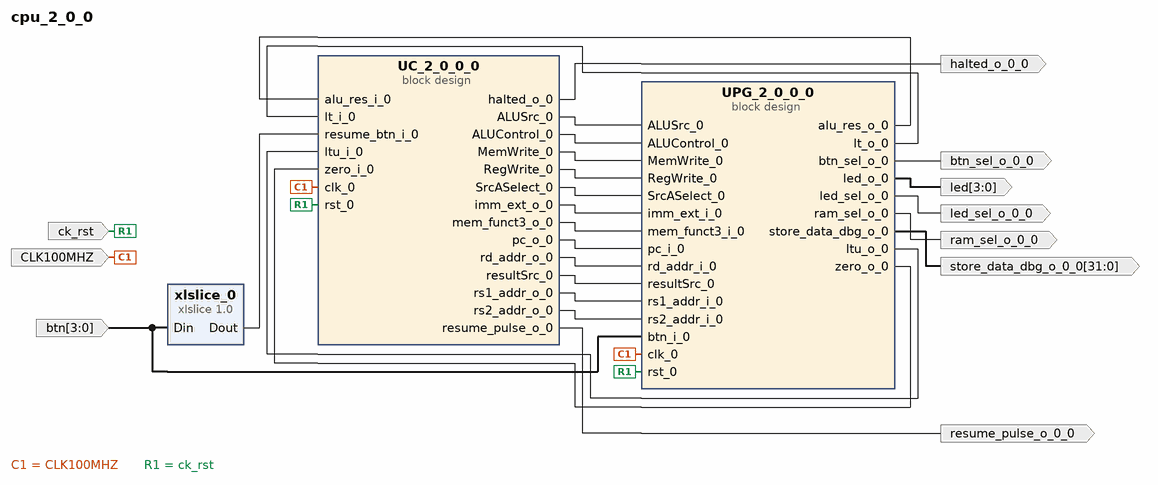
[diagram p0: block diagram of the top level]
# Vivado block design cpu_2_0_0, xc7a100tcsg324-1, Vivado 2025.1
create_bd_design cpu_2_0_0

create_bd_port -dir O -from 31 -to 0 store_data_dbg_o_0_0
create_bd_port -dir O -from 3 -to 0 led
create_bd_port -dir O led_sel_o_0_0
create_bd_port -dir O ram_sel_o_0_0
create_bd_port -dir O btn_sel_o_0_0
create_bd_port -dir I -from 3 -to 0 btn
create_bd_port -dir O halted_o_0_0
create_bd_port -dir O resume_pulse_o_0_0
create_bd_port -dir I -type clk CLK100MHZ
create_bd_port -dir I -type rst ck_rst

create_bd_cell -type container -reference UC_2_0_0 UC_2_0_0_0
set_property -dict [list \
  CONFIG.ACTIVE_SIM_BD UC_2_0_0.bd \
  CONFIG.ACTIVE_SYNTH_BD UC_2_0_0.bd \
  CONFIG.ENABLE_DFX 0 \
  CONFIG.LIST_SIM_BD UC_2_0_0.bd \
  CONFIG.LIST_SYNTH_BD UC_2_0_0.bd \
  CONFIG.LOCK_PROPAGATE 0 \
] [get_bd_cells UC_2_0_0_0]
create_bd_cell -type container -reference UPG_2_0_0 UPG_2_0_0_0
set_property -dict [list \
  CONFIG.ACTIVE_SIM_BD UPG_2_0_0.bd \
  CONFIG.ACTIVE_SYNTH_BD UPG_2_0_0.bd \
  CONFIG.ENABLE_DFX 0 \
  CONFIG.LIST_SIM_BD UPG_2_0_0.bd \
  CONFIG.LIST_SYNTH_BD UPG_2_0_0.bd \
  CONFIG.LOCK_PROPAGATE 0 \
] [get_bd_cells UPG_2_0_0_0]
create_bd_cell -type ip -vlnv xilinx.com:ip:xlslice:1.0 xlslice_0
set_property -dict {CONFIG.DIN_FROM 0 CONFIG.DIN_WIDTH 4} [get_bd_cells xlslice_0]

# ---- connections ----

connect_bd_net -net ALUSrc_0_1 [get_bd_pins UC_2_0_0_0/ALUSrc_0] [get_bd_pins UPG_2_0_0_0/ALUSrc_0]
connect_bd_net [get_bd_pins UC_2_0_0_0/ALUControl_0] [get_bd_pins UPG_2_0_0_0/ALUControl_0]
connect_bd_net [get_bd_pins UC_2_0_0_0/MemWrite_0] [get_bd_pins UPG_2_0_0_0/MemWrite_0]
connect_bd_net [get_bd_pins UC_2_0_0_0/RegWrite_0] [get_bd_pins UPG_2_0_0_0/RegWrite_0]
connect_bd_net [get_bd_pins UC_2_0_0_0/SrcASelect_0] [get_bd_pins UPG_2_0_0_0/SrcASelect_0]
connect_bd_net [get_bd_pins UC_2_0_0_0/halted_o_0] [get_bd_ports halted_o_0_0]
connect_bd_net [get_bd_pins UC_2_0_0_0/imm_ext_o_0] [get_bd_pins UPG_2_0_0_0/imm_ext_i_0]
connect_bd_net [get_bd_pins UC_2_0_0_0/mem_funct3_o_0] [get_bd_pins UPG_2_0_0_0/mem_funct3_i_0]
connect_bd_net [get_bd_pins UC_2_0_0_0/pc_o_0] [get_bd_pins UPG_2_0_0_0/pc_i_0]
connect_bd_net [get_bd_pins UC_2_0_0_0/rd_addr_o_0] [get_bd_pins UPG_2_0_0_0/rd_addr_i_0]
connect_bd_net [get_bd_pins UC_2_0_0_0/resultSrc_0] [get_bd_pins UPG_2_0_0_0/resultSrc_0]
connect_bd_net [get_bd_pins UC_2_0_0_0/resume_pulse_o_0] [get_bd_ports resume_pulse_o_0_0]
connect_bd_net [get_bd_pins UPG_2_0_0_0/alu_res_o_0] [get_bd_pins UC_2_0_0_0/alu_res_i_0]
connect_bd_net [get_bd_pins UPG_2_0_0_0/btn_sel_o_0] [get_bd_ports btn_sel_o_0_0]
connect_bd_net [get_bd_pins UPG_2_0_0_0/led_o_0] [get_bd_ports led]
connect_bd_net [get_bd_pins UPG_2_0_0_0/led_sel_o_0] [get_bd_ports led_sel_o_0_0]
connect_bd_net [get_bd_pins UPG_2_0_0_0/lt_o_0] [get_bd_pins UC_2_0_0_0/lt_i_0]
connect_bd_net [get_bd_pins UPG_2_0_0_0/ltu_o_0] [get_bd_pins UC_2_0_0_0/ltu_i_0]
connect_bd_net [get_bd_pins UPG_2_0_0_0/ram_sel_o_0] [get_bd_ports ram_sel_o_0_0]
connect_bd_net [get_bd_pins UPG_2_0_0_0/store_data_dbg_o_0] [get_bd_ports store_data_dbg_o_0_0]
connect_bd_net [get_bd_pins UPG_2_0_0_0/zero_o_0] [get_bd_pins UC_2_0_0_0/zero_i_0]
connect_bd_net -net btn_i_0_0_1 [get_bd_ports btn] [get_bd_pins UPG_2_0_0_0/btn_i_0] [get_bd_pins xlslice_0/Din]
connect_bd_net -net clk_0_0_1 [get_bd_ports CLK100MHZ] [get_bd_pins UC_2_0_0_0/clk_0] [get_bd_pins UPG_2_0_0_0/clk_0]
connect_bd_net -net rs1_addr_i_0_1 [get_bd_pins UC_2_0_0_0/rs1_addr_o_0] [get_bd_pins UPG_2_0_0_0/rs1_addr_i_0]
connect_bd_net -net rs2_addr_i_0_1 [get_bd_pins UC_2_0_0_0/rs2_addr_o_0] [get_bd_pins UPG_2_0_0_0/rs2_addr_i_0]
connect_bd_net -net rst_0_0_1 [get_bd_ports ck_rst] [get_bd_pins UC_2_0_0_0/rst_0] [get_bd_pins UPG_2_0_0_0/rst_0]
connect_bd_net [get_bd_pins xlslice_0/Dout] [get_bd_pins UC_2_0_0_0/resume_btn_i_0]

validate_bd_design
save_bd_design
